# Altium schematic sheet TermWylPomp1_ds18.SchDoc
size A4; LotOfPieces: 1
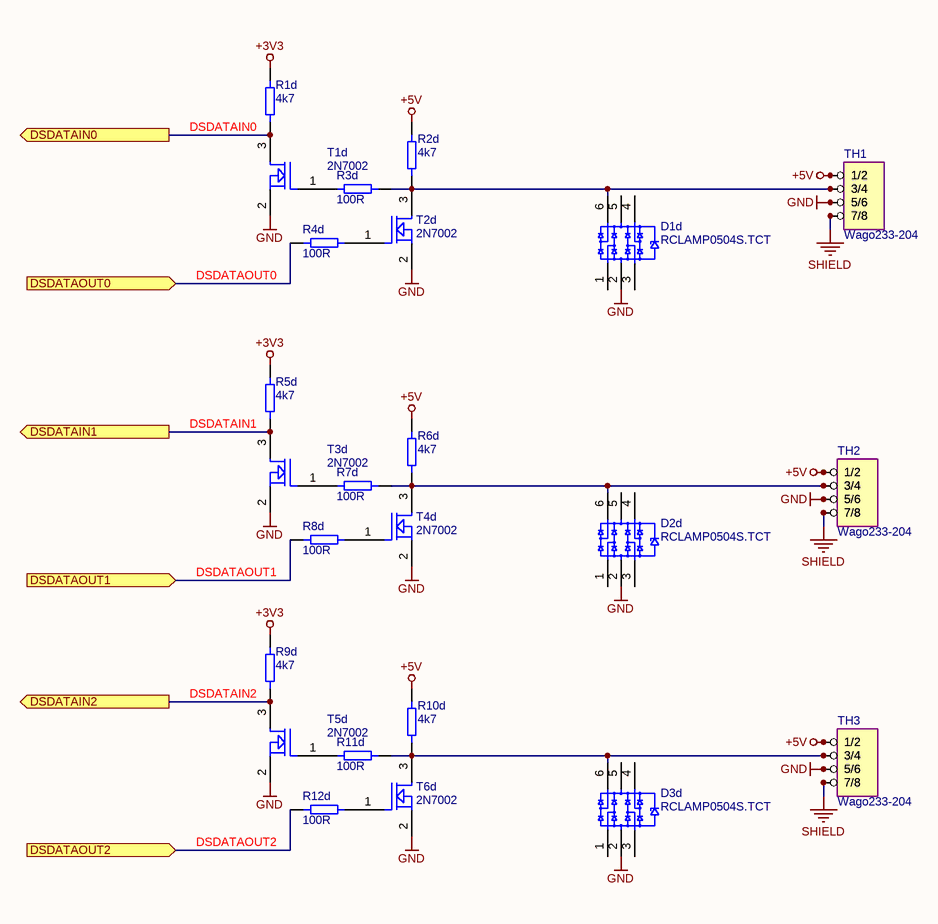
[diagram p0: TermWylPomp1_ds18.SchDoc]

## Parts
D1d  RCLAMP0504S.TCT  [SOT23-6]
D2d  RCLAMP0504S.TCT  [SOT23-6]
D3d  RCLAMP0504S.TCT  [SOT23-6]
R1d  4k7  [0805R]
R2d  4k7  [0805R]
R3d  100R  [0805R]
R4d  100R  [0805R]
R5d  4k7  [0805R]
R6d  4k7  [0805R]
R7d  100R  [0805R]
R8d  100R  [0805R]
R9d  4k7  [0805R]
R10d  4k7  [0805R]
R11d  100R  [0805R]
R12d  100R  [0805R]
T1d  2N7002  [SOT23-3]
T2d  2N7002  [SOT23-3]
T3d  2N7002  [SOT23-3]
T4d  2N7002  [SOT23-3]
T5d  2N7002  [SOT23-3]
T6d  2N7002  [SOT23-3]
TH1  Wago233-204  [Wago233-204]
TH2  Wago233-204  [Wago233-204]
TH3  Wago233-204  [Wago233-204]

## Ports
DSDATAIN0 (out), DSDATAIN1 (out), DSDATAIN2 (out), DSDATAOUT0 (in), DSDATAOUT1 (in), DSDATAOUT2 (in)

## Nets
+3V3: R1d.1 R5d.1 R9d.1
+5V: R2d.1 R6d.1 R10d.1 TH1.1(1/2) TH1.2(1/2) TH2.1(1/2) TH2.2(1/2) TH3.1(1/2) TH3.2(1/2)
GND: D1d.2 D2d.2 D3d.2 T1d.2(SOURCE) T2d.2(SOURCE) T3d.2(SOURCE) T4d.2(SOURCE) T5d.2(SOURCE) T6d.2(SOURCE) TH1.5(5/6) TH1.6(5/6) TH2.5(5/6) TH2.6(5/6) TH3.5(5/6) TH3.6(5/6)
SHIELD: TH1.7(7/8) TH1.8(7/8) TH2.7(7/8) TH2.8(7/8) TH3.7(7/8) TH3.8(7/8)
DSDATAIN0: R1d.2 T1d.3(DRAIN) ; port DSDATAIN0
DSDATAIN1: R5d.2 T3d.3(DRAIN) ; port DSDATAIN1
DSDATAIN2: R9d.2 T5d.3(DRAIN) ; port DSDATAIN2
DSDATAOUT0: R4d.1 ; port DSDATAOUT0
DSDATAOUT1: R8d.1 ; port DSDATAOUT1
DSDATAOUT2: R12d.1 ; port DSDATAOUT2
NetD1d_6: D1d.6 R2d.2 R3d.2 T2d.3(DRAIN) TH1.3(3/4) TH1.4(3/4)
NetD2d_6: D2d.6 R6d.2 R7d.2 T4d.3(DRAIN) TH2.3(3/4) TH2.4(3/4)
NetD3d_6: D3d.6 R10d.2 R11d.2 T6d.3(DRAIN) TH3.3(3/4) TH3.4(3/4)
NetR3d_1: R3d.1 T1d.1(GATE)
NetR4d_2: R4d.2 T2d.1(GATE)
NetR7d_1: R7d.1 T3d.1(GATE)
NetR8d_2: R8d.2 T4d.1(GATE)
NetR11d_1: R11d.1 T5d.1(GATE)
NetR12d_2: R12d.2 T6d.1(GATE)

Not connected (* = marked no-connect by the designer): D1d 1 3 4 5; D2d 1 3 4 5; D3d 1 3 4 5

## Notes on the sheet
- Wariant:
- Rev.
- /
- Projekt i wykonanie: (C) Miroslaw Lach MRQ, www.mlach.com
- git:
- Page:
- Plik:

## Library data of the parts
D1d D2d D3d = DIO7: Descript: Dioda: drabinka diodowa; 6V; 6A; jednokierunkowa; 150W; SOT23-6; Kod: DIO7; ID: 7; Value: RCLAMP0504S.TCT; Reference5: RCLAMP0504S.TCT; Supplier5: tme.pl; Manufacturer5: SEMTECH; Price5: 1; Typ5: RCLAMP0504S.TCT; DateOfPrice5: 2010-01-01
R1d R2d R5d R6d R9d R10d = Res172: Descript: Rezystor: thick film; SMD; 0805; 4,7kΩ; 0,125W; ±1%; -55÷125°C; Reference5: SMD0805-4K7-1%; Typ5: 0805S8F4701T5E; Kod: Res172; ID: 172; Value: 4k7; Supplier5: tme.pl; Manufacturer5: Royal Ohm; Price5: 0,1; DateOfPrice5: 2020-06-25 12:16:54
R3d R4d R7d R8d R11d R12d = Res13: Descript: Rezystor: thick film; SMD; 0805; 100om; 0,125W; ±1%; -55÷125°C; Reference5: SMD0805-100R-1%; Typ5: 0805S8F1000T5E; Kod: Res13; ID: 13; Value: 100R; Supplier5: tme.pl; Manufacturer5: Royal Ohm; Price5: 0,1; DateOfPrice5: 2020-06-25 12:16:54
T1d T2d T3d T4d T5d T6d = Tra2: Descript: Tranzystor: N-MOSFET; unipolarny; 60V; 800mA; 200mW; SOT23; Kod: Tra2; ID: 2; Value: 2N7002; Supplier5: tme.pl; Reference5: 2N7002; Price5: 0; DateOfPrice5: 2010-01-01; Manufacturer5: Fairchild; Typ5: 2N7002
TH1-TH3 = Con261: Descript: PCB terminal strip with push buttons 0.5mm2; Reference5: 112495; Kod: Con261; ID: 261; Replacement: bd; Value: Wago233-204; Supplier5: soselectronic.pl; Price5: 5; DateOfPrice5: 2010-01-01; Manufacturer5: Wago; Typ5: 233-204